# EAGLE schematic shematics (EAGLE 9.6.2)
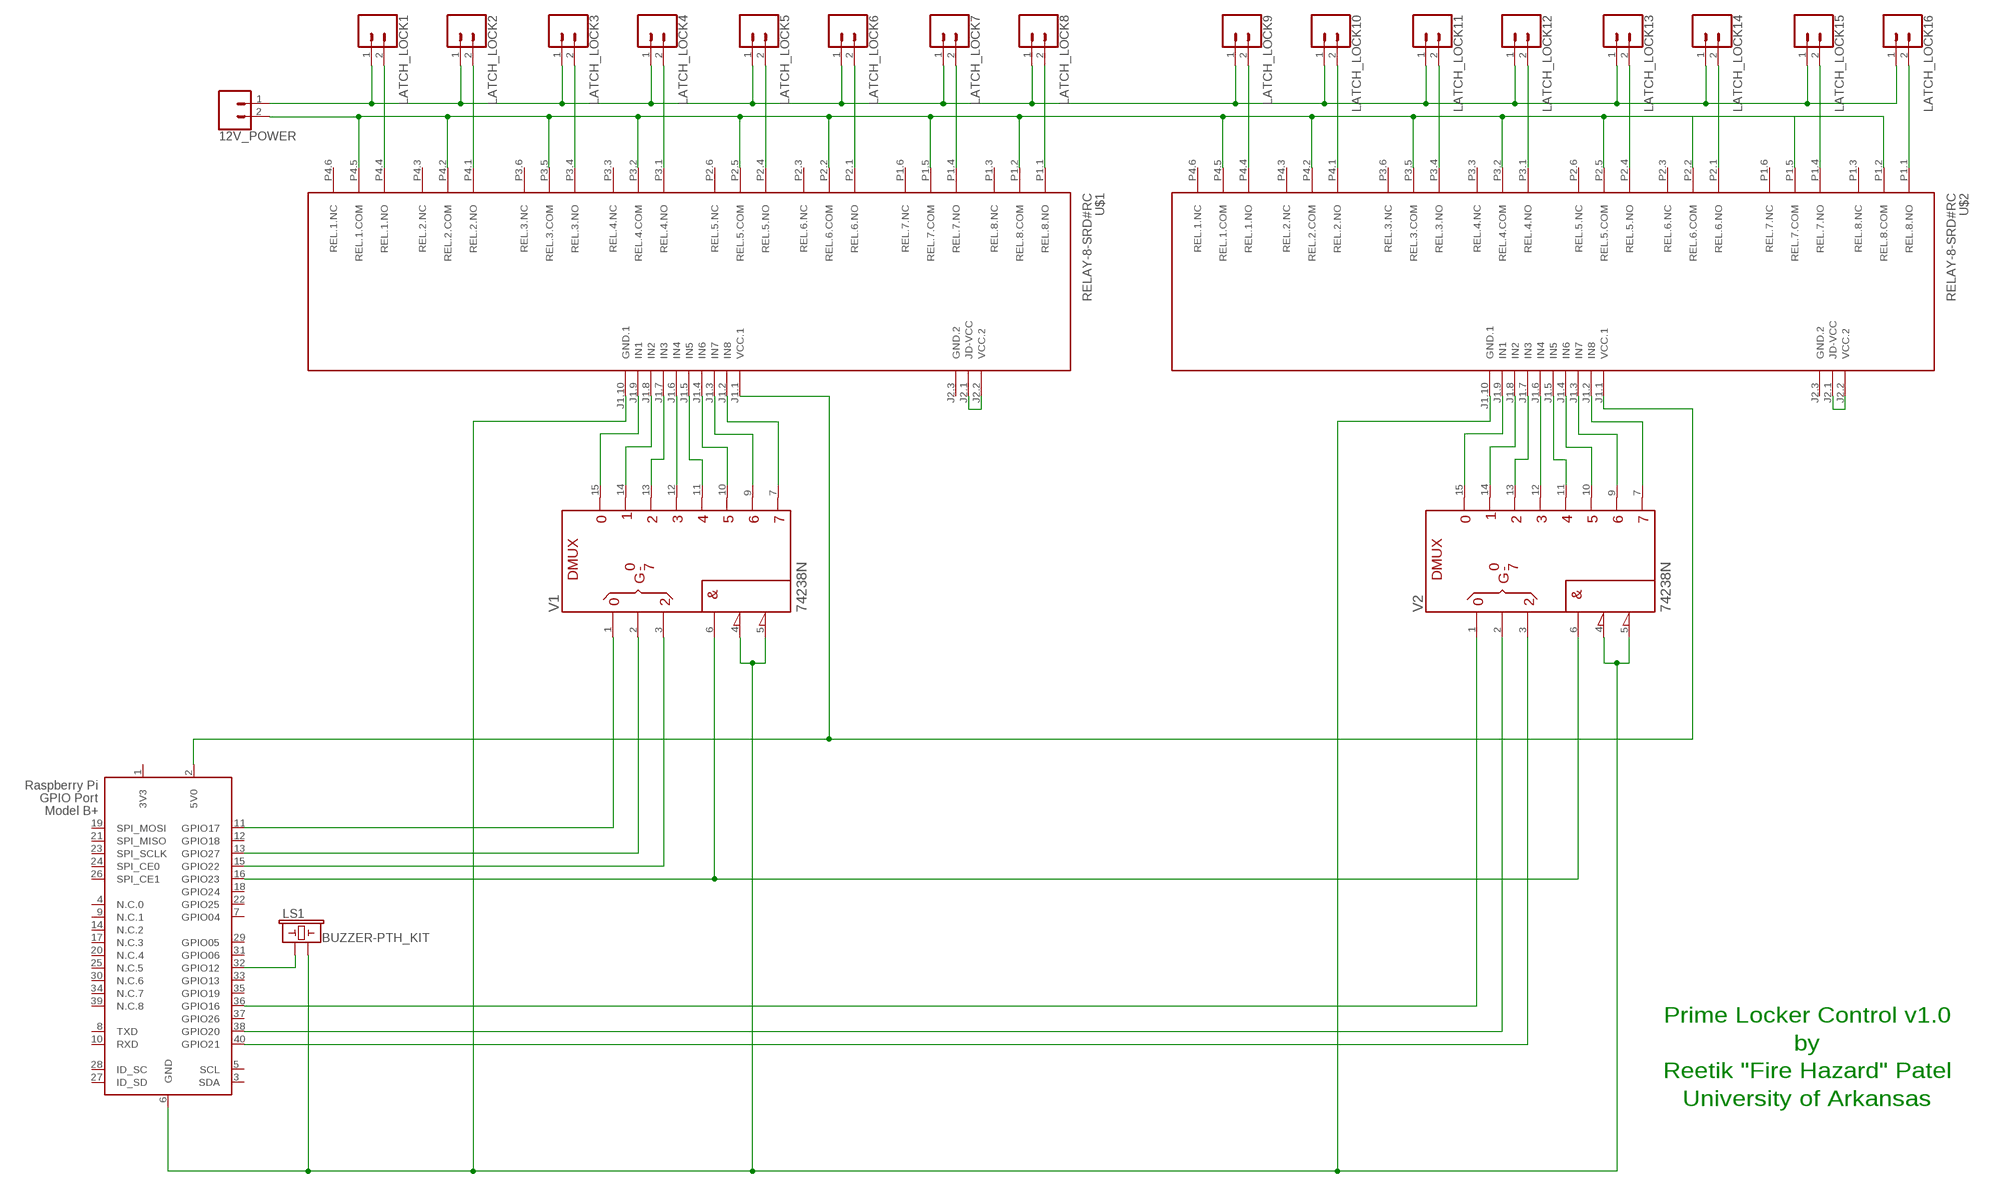
[diagram p0: schematic, sheet 1]

## Parts
12V_POWER  CONN_02JST-PTH-2  [JST-2-PTH]
LATCH_LOCK1  CONN_02JST-PTH-2  [JST-2-PTH]
LATCH_LOCK2  CONN_02JST-PTH-2  [JST-2-PTH]
LATCH_LOCK3  CONN_02JST-PTH-2  [JST-2-PTH]
LATCH_LOCK4  CONN_02JST-PTH-2  [JST-2-PTH]
LATCH_LOCK5  CONN_02JST-PTH-2  [JST-2-PTH]
LATCH_LOCK6  CONN_02JST-PTH-2  [JST-2-PTH]
LATCH_LOCK7  CONN_02JST-PTH-2  [JST-2-PTH]
LATCH_LOCK8  CONN_02JST-PTH-2  [JST-2-PTH]
LATCH_LOCK9  CONN_02JST-PTH-2  [JST-2-PTH]
LATCH_LOCK10  CONN_02JST-PTH-2  [JST-2-PTH]
LATCH_LOCK11  CONN_02JST-PTH-2  [JST-2-PTH]
LATCH_LOCK12  CONN_02JST-PTH-2  [JST-2-PTH]
LATCH_LOCK13  CONN_02JST-PTH-2  [JST-2-PTH]
LATCH_LOCK14  CONN_02JST-PTH-2  [JST-2-PTH]
LATCH_LOCK15  CONN_02JST-PTH-2  [JST-2-PTH]
LATCH_LOCK16  CONN_02JST-PTH-2  [JST-2-PTH]
LS1  BUZZER-PTH_KIT  [BUZZER-12MM-KIT]
U$1  RELAY-8-SRD#RC  [RELAY-8-SRD#RC]
U$2  RELAY-8-SRD#RC  [RELAY-8-SRD#RC]
V1  74238N  [DIL16]
V2  74238N  [DIL16]
X1  RASPI_BOARD_B+_F  [RASPI_BOARD_B+_FULL]

## Nets
N$1: U$1.J1.9(IN1) V1.15(Y0)
N$2: U$1.J1.8(IN2) V1.14(Y1)
N$3: U$1.J1.7(IN3) V1.13(Y2)
N$4: U$1.J1.6(IN4) V1.12(Y3)
N$5: U$1.J1.5(IN5) V1.11(Y4)
N$6: U$1.J1.4(IN6) V1.10(Y5)
N$7: U$1.J1.3(IN7) V1.9(Y6)
N$8: U$1.J1.2(IN8) V1.7(Y7)
N$9: V1.1(A) X1.11(GPIO17)
N$10: V1.2(B) X1.13(GPIO27)
N$11: V1.3(C) X1.15(GPIO22)
N$12: V1.6(G1) V2.6(G1) X1.16(GPIO23)
N$13: V2.3(C) X1.40(GPIO21)
N$14: U$2.J1.9(IN1) V2.15(Y0)
N$15: U$2.J1.8(IN2) V2.14(Y1)
N$16: U$2.J1.7(IN3) V2.13(Y2)
N$17: U$2.J1.6(IN4) V2.12(Y3)
N$18: U$2.J1.5(IN5) V2.11(Y4)
N$19: U$2.J1.4(IN6) V2.10(Y5)
N$20: U$2.J1.3(IN7) V2.9(Y6)
N$21: U$2.J1.2(IN8) V2.7(Y7)
N$22: LS1.- U$1.J1.10(GND.1) U$2.J1.10(GND.1) V1.4(!G2A) V1.5(!G2B) V2.4(!G2A) V2.5(!G2B) X1.6(GND)
N$23: V2.1(A) X1.36(GPIO16)
N$24: V2.2(B) X1.38(GPIO20)
N$25: U$1.J1.1(VCC.1) U$2.J1.1(VCC.1) X1.2(5V0)
N$26: LS1.+ X1.32(GPIO12)
N$27: U$1.J2.1(JD-VCC) U$1.J2.2(VCC.2)
N$28: U$2.J2.1(JD-VCC) U$2.J2.2(VCC.2)
N$29: 12V_POWER.2 U$1.P1.2(REL.8.COM) U$1.P1.5(REL.7.COM) U$1.P2.2(REL.6.COM) U$1.P2.5(REL.5.COM) U$1.P3.2(REL.4.COM) U$1.P3.5(REL.3.COM) U$1.P4.2(REL.2.COM) U$1.P4.5(REL.1.COM) U$2.P1.2(REL.8.COM) U$2.P1.5(REL.7.COM) U$2.P2.2(REL.6.COM) U$2.P2.5(REL.5.COM) U$2.P3.2(REL.4.COM) U$2.P3.5(REL.3.COM) U$2.P4.2(REL.2.COM) U$2.P4.5(REL.1.COM)
N$30: LATCH_LOCK1.2 U$1.P4.4(REL.1.NO)
N$31: LATCH_LOCK8.2 U$1.P1.1(REL.8.NO)
N$32: 12V_POWER.1 LATCH_LOCK1.1 LATCH_LOCK2.1 LATCH_LOCK3.1 LATCH_LOCK4.1 LATCH_LOCK5.1 LATCH_LOCK6.1 LATCH_LOCK7.1 LATCH_LOCK8.1 LATCH_LOCK9.1 LATCH_LOCK10.1 LATCH_LOCK11.1 LATCH_LOCK12.1 LATCH_LOCK13.1 LATCH_LOCK14.1 LATCH_LOCK15.1 LATCH_LOCK16.1
N$33: LATCH_LOCK7.2 U$1.P1.4(REL.7.NO)
N$34: LATCH_LOCK6.2 U$1.P2.1(REL.6.NO)
N$35: LATCH_LOCK5.2 U$1.P2.4(REL.5.NO)
N$36: LATCH_LOCK4.2 U$1.P3.1(REL.4.NO)
N$37: LATCH_LOCK3.2 U$1.P3.4(REL.3.NO)
N$38: LATCH_LOCK2.2 U$1.P4.1(REL.2.NO)
N$39: LATCH_LOCK16.2 U$2.P1.1(REL.8.NO)
N$40: LATCH_LOCK15.2 U$2.P1.4(REL.7.NO)
N$41: LATCH_LOCK14.2 U$2.P2.1(REL.6.NO)
N$42: LATCH_LOCK13.2 U$2.P2.4(REL.5.NO)
N$43: LATCH_LOCK12.2 U$2.P3.1(REL.4.NO)
N$44: LATCH_LOCK11.2 U$2.P3.4(REL.3.NO)
N$45: LATCH_LOCK10.2 U$2.P4.1(REL.2.NO)
N$46: LATCH_LOCK9.2 U$2.P4.4(REL.1.NO)
Unconnected: U$1.P1.3(REL.8.NC) U$1.P1.6(REL.7.NC) U$1.P2.3(REL.6.NC) U$1.P2.6(REL.5.NC) U$1.P3.3(REL.4.NC) U$1.P3.6(REL.3.NC) U$1.P4.3(REL.2.NC) U$1.P4.6(REL.1.NC) U$2.P1.3(REL.8.NC) U$2.P1.6(REL.7.NC) U$2.P2.3(REL.6.NC) U$2.P2.6(REL.5.NC) U$2.P3.3(REL.4.NC) U$2.P3.6(REL.3.NC) U$2.P4.3(REL.2.NC) U$2.P4.6(REL.1.NC) X1.3(SDA) X1.4(N.C.0) X1.5(SCL) X1.7(GPIO04) X1.8(TXD) X1.9(N.C.1) X1.10(RXD) X1.12(GPIO18) X1.14(N.C.2) X1.17(N.C.3) X1.18(GPIO24) X1.19(SPI_MOSI) X1.20(N.C.4) X1.21(SPI_MISO) X1.22(GPIO25) X1.23(SPI_SCLK) X1.24(SPI_CE0) X1.25(N.C.5) X1.26(SPI_CE1) X1.27(ID_SD) X1.28(ID_SC) X1.29(GPIO05) X1.30(N.C.6) X1.31(GPIO06) X1.33(GPIO13) X1.34(N.C.7) X1.35(GPIO19) X1.37(GPIO26) X1.39(N.C.8)

## Notes on the sheet
- Prime Locker Control v1.0
  by
  Reetik "Fire Hazard" Patel
  University of Arkansas

## Power pins joined to a net without a drawn wire
3V3: X1.1(3V3)
+UB: V1.16(+UB) V2.16(+UB)
-UB: V1.8(-UB) V2.8(-UB)
GND.2: U$1.J2.3(GND.2) U$2.J2.3(GND.2)

## Library data of the parts
12V_POWER LATCH_LOCK1-LATCH_LOCK16 = SparkFun-Connectors:CONN_02: Multi connection point. Often used as Generic Header-pin footprint for 0.1 inch spaced/style header connections On any of the 0.1 inch spaced packages, you can populate with these: Break Away Headers - Straight <https://www.sparkfun.com/products/116> (PRT-00116) Break Away Male Headers - Right Angle <https://www.sparkfun.com/products/553> (PRT-00553) Female Headers <https://www.sparkfun.com/products/115> (PRT-00115) Break Away Headers - Machine Pin <https://www.sparkfun.com/products/117> (PRT-00117) Break Away Female Headers - Swiss Machine Pin <https://www.sparkfun.com/products/743> (PRT-00743) For SCREWTERMINALS and SPRING TERMINALS visit here: Screw Terimnals on SparkFun.com <https://www.sparkfun.com/search/results?term=Screw+Terminals> (5mm/3.5mm/2.54mm spacing) This device is also useful as a general connection point to wire up your design to another part of your project. Our various solder wires solder well into these plated through hole pads. Hook-Up Wire - Assortment (Stranded, 22 AWG) <https://www.sparkfun.com/products/11375> (PRT-11375) Hook-Up Wire - Assortment (Solid Core, 22 AWG) <https://www.sparkfun.com/products/11367> (PRT-11367) View the entire wire category on our website here <https://www.sparkfun.com/categories/141> Special notes: Molex polarized connector foot print use with: PRT-08233 with associated crimp pins and housings. 2.54_SCREWTERM for use with PRT-10571. 3.5mm Screw Terminal footprints for PRT-08084 5mm Screw Terminal footprints for use with PRT-08432; PROD_ID: CONN-09863; SKU: PRT-09914
LS1 = SparkFun-Electromechanical:BUZZER: Buzzer Small round buzzers that operate around the audible 2kHz range. You can use these as speakers to create simple music or user interfaces. Variant Overview: PTH - Mini Speaker - PC Mount 12mm 2.048kHz <https://www.sparkfun.com/products/7950> PTH_KIT - Mini Speaker - PC Mount 12mm 2.048kHz <https://www.sparkfun.com/products/7950> KIT simplifies soldering by adding stop mask to one side of the pads. PTH_NO_SILK - Mini Speaker - PC Mount 12mm 2.048kHz <https://www.sparkfun.com/products/7950> No silkscreen indicator of buzzer outline. PTH_KIT_NO_SILK - Mini Speaker - PC Mount 12mm 2.048kHz <https://www.sparkfun.com/products/7950> KIT package w/o silkscreen SMD - Buzzer Audio Magnetic (CCV-084B16) SMD buzzer used on, e.g. the LilyPad Buzzer <https://www.sparkfun.com/products/8463> and RFID USB Reader <https://www.sparkfun.com/products/9963>. SMD_KIT - Buzzer Audio Magnetic (CCV-084B16) SMD Buzzer with elongated pins to make soldering easier. Used on the SparkFun Simon Says - Surface Mount Soldering Kit <https://www.sparkfun.com/products/10935>.; PROD_ID: COMP-08253; SF_SKU: COM-07950
U$1 U$2 = diy-modules:RELAY-8-SRD#RC: 8-Channel Relay Module based on SRD-05VDC-SL-C relays Symbol with relays pins Click here to find device on ebay.com <http://www.ebay.com/sch/eight+channel+relay+module+optocoupler+5v>
V1 V2 = 74ttl-din:74*238: 1 of 8 noninverting DECODER/DEMULTIPLEXER
X1 = raspberrypi_bastelstube_v13:RASPI_BOARD_B+: Raspberry Pi GPIO connector with markings for the outer dimensions of the Raspberry Pi board model B+ with different sets of drill holes or mounting pads